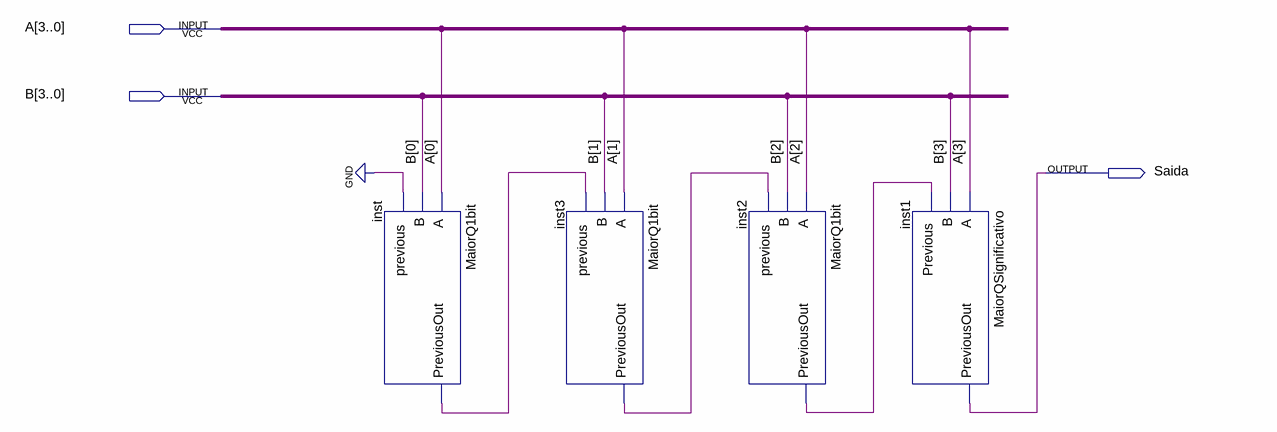
[diagram p0: schematic sheet]
// Quartus schematic ComparadorMaiorQVetor.bdf as structural Verilog: 4 symbols, 3 pins
module ComparadorMaiorQVetor (
  input  [3:0] A,
  input  [3:0] B,
  output Saida
);

  wire inst2_previousout, inst3_previousout, inst_previousout;

  MaiorQ1bit inst (.A(A[0]), .B(B[0]), .previous(1'b0), .PreviousOut(inst_previousout));
  MaiorQ1bit inst3 (.A(A[1]), .B(B[1]), .previous(inst_previousout), .PreviousOut(inst3_previousout));
  MaiorQ1bit inst2 (.A(A[2]), .B(B[2]), .previous(inst3_previousout), .PreviousOut(inst2_previousout));
  MaiorQSignificativo inst1 (.A(A[3]), .B(B[3]), .Previous(inst2_previousout), .PreviousOut(Saida));
endmodule
